# Altium schematic sheet MT8365.SchDoc
size A3; Author: Nguyễn Hữu Thắng; DrawnBy: Nguyễn Hữu Thắng; SheetNumber: 2; SheetTotal: 35
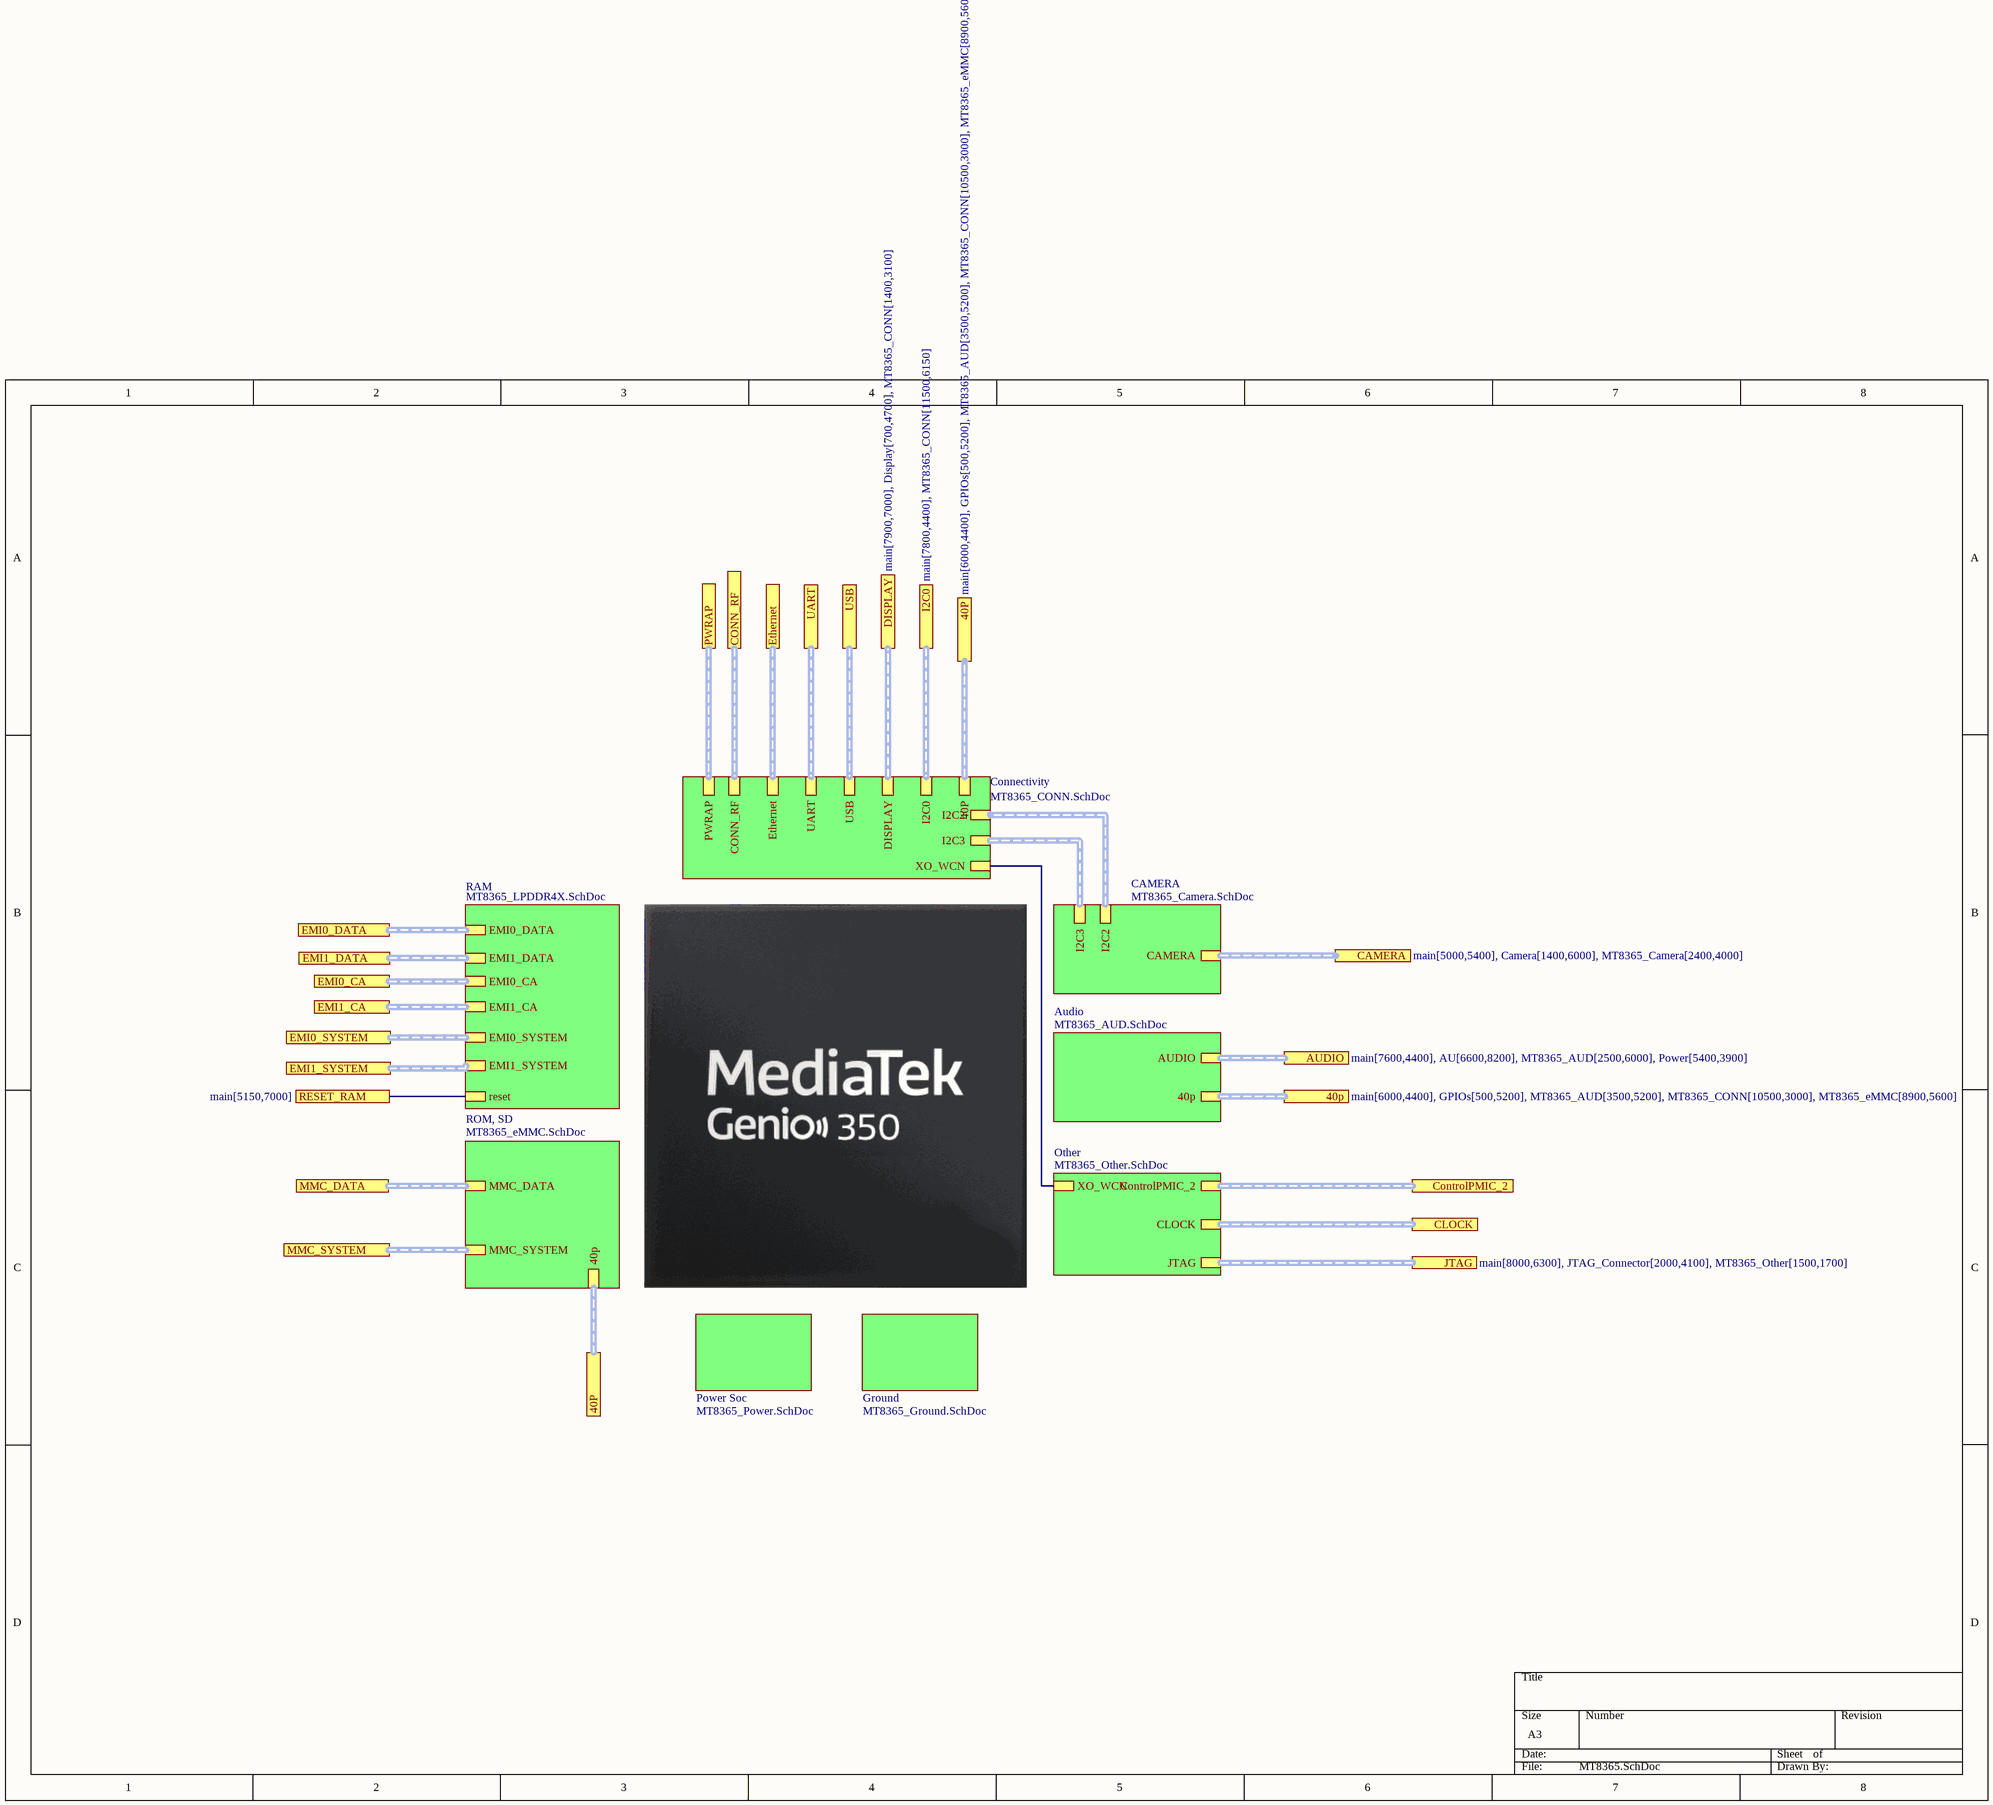
[diagram p0: MT8365.SchDoc]

## Sub-sheets
Audio = MT8365_AUD.SchDoc: AUDIO, 40p
CAMERA = MT8365_Camera.SchDoc: CAMERA, I2C3, I2C2
Connectivity = MT8365_CONN.SchDoc: PWRAP, XO_WCN, CONN_RF, Ethernet, UART, USB, I2C3, I2C2, DISPLAY, 40P, I2C0
Ground = MT8365_Ground.SchDoc: no entries
Other = MT8365_Other.SchDoc: ControlPMIC_2, CLOCK, XO_WCN, JTAG
Power Soc = MT8365_Power.SchDoc: no entries
RAM = MT8365_LPDDR4X.SchDoc: EMI0_DATA, EMI1_DATA, EMI0_CA, EMI1_CA, EMI1_SYSTEM, EMI0_SYSTEM, reset
ROM, SD = MT8365_eMMC.SchDoc: MMC_DATA, MMC_SYSTEM, 40p

## Ports
40P (harness 40p, see main[6000,4400], GPIOs[500,5200], MT8365_AUD[3500,5200], MT8365_CONN[10500,3000], MT8365_eMMC[8900,5600]), 40p (see main[6000,4400], GPIOs[500,5200], MT8365_AUD[3500,5200], MT8365_CONN[10500,3000], MT8365_eMMC[8900,5600]), AUDIO (see main[7600,4400], AU[6600,8200], MT8365_AUD[2500,6000], Power[5400,3900]), CAMERA (see main[5000,5400], Camera[1400,6000], MT8365_Camera[2400,4000]), CLOCK (see main[6700,4400], MT8365_Other[1500,5800], Power[11000,5700], RTC_Miscellaneous[2500,1800]), CONN_RF (see main[5000,4600], MT6631[10400,3000], MT8365_CONN[700,7400]), ControlPMIC_2 (see main[7300,4400], Control_Interface[3100,2200], MT8365_Other[1000,3700], Power[9700,9000]), DISPLAY (see main[7900,7000], Display[700,4700], MT8365_CONN[1400,3100]), EMI0_CA (see main[6200,7000], LPDDR4X[7000,9400], LPDDR4X_Channel_A[2700,5600], MT8365_LPDDR4X[7500,5500]), EMI0_DATA (see main[6700,7000], LPDDR4X[7000,9820], LPDDR4X_Channel_A[8000,5200], MT8365_LPDDR4X[7800,9200]), EMI0_SYSTEM (see main[5700,7000], LPDDR4X[7000,8860], LPDDR4X_Channel_A[7000,2300], MT8365_LPDDR4X[8200,3000]), EMI1_CA (see main[6000,7000], LPDDR4X[7020,7400], LPDDR4X_Channel_B[2700,5600], MT8365_LPDDR4X[7500,4500]), EMI1_DATA (see main[6500,7000], LPDDR4X[7000,7900], LPDDR4X_Channel_B[8000,5200], MT8365_LPDDR4X[7800,7200]), EMI1_SYSTEM (see main[5400,7000], LPDDR4X[7000,6900], LPDDR4X_Channel_B[7500,1700], MT8365_LPDDR4X[8200,1300]), Ethernet (see main[7600,7000], MT8365_CONN[13494.004,8500], RTL8201F[9500,2400]), I2C0 (see main[7800,4400], MT8365_CONN[11500,6150]), JTAG (see main[8000,6300], JTAG_Connector[2000,4100], MT8365_Other[1500,1700]), MMC_DATA (see main[5000,6700], eMMC[6000,4540], MT8365_eMMC[1884.259,5540]), MMC_SYSTEM (see main[5000,6400], eMMC[5900,3640], MT8365_eMMC[2879.674,1840]), PWRAP (see main[7000,4400], Control_Interface[3900,4400], MT8365_CONN[4500,8700], Power[9100,9000]), RESET_RAM (see main[5150,7000]), UART (see main[8000,5600], MT8365_CONN[11800,6800], UART[1600,5800]), USB (see main[8000,4700], MT8365_CONN[2500,5900], USB[700,4700])

## Nets
RESET_RAM: port RESET_RAM, sheet RAM/reset
(unnamed): sheet Connectivity/XO_WCN, sheet Other/XO_WCN

## Buses and harness runs
harness port 40p = sheet Audio/40p
harness port 40P = sheet Connectivity/40P
harness port 40P = sheet ROM, SD/40p
harness port AUDIO = sheet Audio/AUDIO
harness port CAMERA = sheet CAMERA/CAMERA
harness port CLOCK = sheet Other/CLOCK
harness port CONN_RF = sheet Connectivity/CONN_RF
harness port ControlPMIC_2 = sheet Other/ControlPMIC_2
harness port DISPLAY = sheet Connectivity/DISPLAY
harness port EMI0_CA = sheet RAM/EMI0_CA
harness port EMI0_DATA = sheet RAM/EMI0_DATA
harness port EMI0_SYSTEM = sheet RAM/EMI0_SYSTEM
harness port EMI1_CA = sheet RAM/EMI1_CA
harness port EMI1_DATA = sheet RAM/EMI1_DATA
harness port EMI1_SYSTEM = sheet RAM/EMI1_SYSTEM
harness port Ethernet = sheet Connectivity/Ethernet
harness port I2C0 = sheet Connectivity/I2C0
harness port JTAG = sheet Other/JTAG
harness port MMC_DATA = sheet ROM, SD/MMC_DATA
harness port MMC_SYSTEM = sheet ROM, SD/MMC_SYSTEM
harness port PWRAP = sheet Connectivity/PWRAP
harness port UART = sheet Connectivity/UART
harness port USB = sheet Connectivity/USB
harness sheet CAMERA/I2C2 = sheet Connectivity/I2C2
harness sheet CAMERA/I2C3 = sheet Connectivity/I2C3